# Altium schematic sheet RFID_system.SchDoc
size A4
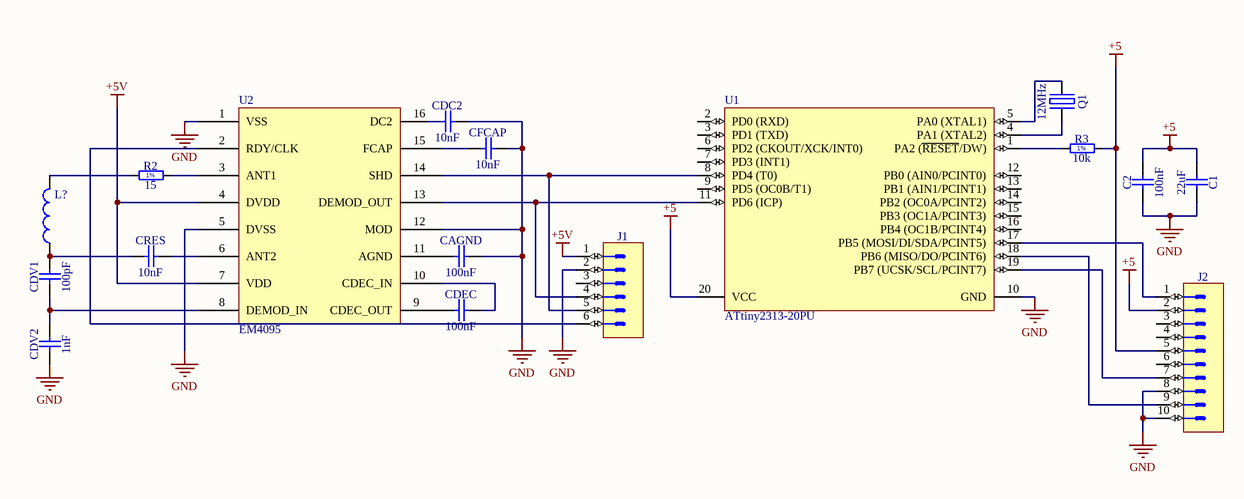
[diagram p0: RFID_system.SchDoc]

## Parts
C1  22uF  [CAPC2012X135N]
C2  100nF  [CAPC2012X135N]
CAGND  100nF  [CAPC2012X135N]
CDC2  10nF  [CAPC2012X135N]
CDEC  100nF  [CAPC2012X135N]
CDV1  100pF  [CAPC2012X88N]
CDV2  1nF  [CAPC2013X100N]
CFCAP  10nF  [CAPC2012X135N]
CRES  10nF  [CAPC2012X135N]
J1  C-Grid III™  [MOLEX_90136-1206]  (value not drawn)
J2  C-Grid®  [MOLEX_70246-1004]  (value not drawn)
L?  (no value)  [0402-A]
Q1  12MHz  [XTAL_TXC_7A]
R2  15  [RESC3216X65N]
R3  10k  [RESC3216X65N]
U1  ATtiny2313-20PU  [20P3]
U2  EM4095

## Nets
+5: C1.1 C2.2 J2.2 J2.5 R3.1 U1.20(VCC)
+5V: J1.1 U2.4(DVDD) U2.7(VDD)
GND: C1.2 C2.1 CAGND.2 CDC2.2 CDV2.1 CFCAP.2 J1.2 J2.8 J2.10 U1.10(GND) U2.1(VSS) U2.5(DVSS) U2.12(MOD)
NetCAGND_1: CAGND.1 U2.11(AGND)
NetCDC2_1: CDC2.1 U2.16(DC2)
NetCDEC_1: CDEC.1 U2.9(CDEC_OUT)
NetCDEC_2: CDEC.2 U2.10(CDEC_IN)
NetCDV1_1: CDV1.1 CDV2.2 U2.8(DEMOD_IN)
NetCDV1_2: CDV1.2 CRES.1 L?.1
NetCFCAP_1: CFCAP.1 U2.15(FCAP)
NetCRES_2: CRES.2 U2.6(ANT2)
NetJ1_4: J1.4 U1.11(PD6_(ICP)) U2.13(DEMOD_OUT)
NetJ1_5: J1.5 U1.8(PD4_(T0)) U2.14(SHD)
NetJ1_6: J1.6 U2.2(RDY/CLK)
NetJ2_1: J2.1 U1.17(PB5_(MOSI/DI/SDA/PCINT5))
NetJ2_7: J2.7 U1.19(PB7_(UCSK/SCL/PCINT7))
NetJ2_9: J2.9 U1.18(PB6_(MISO/DO/PCINT6))
NetL?_2: L?.2 R2.1
NetQ1_1: Q1.1(OSC1) U1.5(PA0_(XTAL1))
NetQ1_2: Q1.2(OSC2) U1.4(PA1_(XTAL2))
NetR2_2: R2.2 U2.3(ANT1)
NetR3_2: R3.2 U1.1(PA2_(~{RESET}/DW))

Not connected (* = marked no-connect by the designer): J1 3; J2 3 4 6; U1 2(PD0_(RXD)) 3(PD1_(TXD)) 6(PD2_(CKOUT/XCK/INT0)) 7(PD3_(INT1)) 9(PD5_(OC0B/T1)) 12(PB0_(AIN0/PCINT0)) 13(PB1_(AIN1/PCINT1)) 14(PB2_(OC0A/PCINT2)) 15(PB3_(OC1A/PCINT3)) 16(PB4_(OC1B/PCINT4))

## Notes on the sheet
- (in symbol R1206_10K_1%_0.5W_100PPM_VISHAY_CRCW-HP e3) 1%

## Library data of the parts
C1 = CC0805_22UF_16V_10%_X5R: Non-polarised capacitor; Part Description: SMD Multilayer Chip Ceramic Capacitor; Manufacturer: GENERIC; Manufacturer1 Part Number: C2012X5R1C226KT; Voltage: 16V; TC: X5R; Tolerance: ±10%; Part Number: CC0805_22UF_16V_10%_X5R; Component Kind: Standard; Component Type: Standard; Pin Count: 2; Value: 22uF; Status: Preferred; Manufacturer Part Number: CC0805_22UF_16V_10%_X5R; Case: 0805; Mounted: Yes; Socket: No; SMD: Yes; Sense: No; Manufacturer1 Example: TDK; Manufacturer1 ComponentHeight: 1.35mm; HelpURL: \\cern.ch\dfs\Applications\Altium\Datasheets\CC0805_X5R_TDK_C.pdf; Author: CERN DEM JLC; CreateDate: 2012-10-25; LatestRevisionDate: 2012-10-25
C2 CAGND CDEC = CC0805_100NF_50V_10%_X7R: Non-polarised capacitor; Part Description: SMD Multilayer Chip Ceramic Capacitor; Manufacturer: GENERIC; Manufacturer1 Part Number: C2012X7R1H104K085AA; Voltage: 50V; TC: X7R; Tolerance: ±10%; Part Number: CC0805_100NF_50V_10%_X7R; Component Kind: Standard; Component Type: Standard; Pin Count: 2; Value: 100nF; Status: Preferred; Manufacturer Part Number: CC0805_100NF_50V_10%_X7R; Case: 0805; Mounted: Yes; Socket: No; SMD: Yes; Sense: No; Manufacturer1 Example: TDK; Manufacturer1 ComponentHeight: 1mm; HelpURL: \\cern.ch\dfs\Applications\Altium\Datasheets\CC0805_X7R_TDK_C.pdf; Author: CERN DEM JLC; CreateDate: 2007-12-03; LatestRevisionDate: 2015-04-22
CDC2 CFCAP CRES = CC0805_10NF_50V_5%_X7R: Non-polarised capacitor; Part Description: SMD Multilayer Chip Ceramic Capacitor; Manufacturer: GENERIC; Manufacturer1 Part Number: 08055C103JAT2A; Voltage: 50V; TC: X7R; Tolerance: ±5%; Part Number: CC0805_10NF_50V_5%_X7R; Component Kind: Standard; Component Type: Standard; Pin Count: 2; Value: 10nF; Status: None; Manufacturer Part Number: CC0805_10NF_50V_5%_X7R; Case: 0805; Mounted: Yes; Socket: No; SMD: Yes; Sense: No; Manufacturer1 Example: AVX; Manufacturer1 ComponentHeight: 0.94mm; HelpURL: \\cern.ch\dfs\Applications\Altium\Datasheets\CC0805_X7R_AVX.pdf; Author: CERN DEM JLC; CreateDate: 2011-01-18; LatestRevisionDate: 2011-01-18
CDV1 = CC0805_100PF_50V_5%_C0G_KEMET_C0805C101J5GACAUTO: Non-polarised capacitor; Part Description: SMD Multilayer Chip Ceramic Capacitor (Automotive Grade); Manufacturer: KEMET; Voltage: 50V; TC: C0G/NP0; Tolerance: ±5%; Part Number: CC0805_100PF_50V_5%_C0G_KEMET_C0805C101J5GACAUTO; Component Kind: Standard; Component Type: Standard; Pin Count: 2; Value: 100pF; Status: Not Recommended; Manufacturer Part Number: C0805C101J5GACAUTO; Case: 0805; Mounted: Yes; Socket: No; SMD: Yes; Sense: No; ComponentHeight: 0.88mm; HelpURL: \\cern.ch\dfs\Applications\Altium\Datasheets\CC0805_KEMET_C0805C101J5GACAUTO.pdf; Author: CERN DEM BC; CreateDate: 2016-02-26; LatestRevisionDate: 2016-02-26
CDV2 = CC0805_1NF_25V_1%_C0G: Non-polarised capacitor; Part Description: SMD Multilayer Chip Ceramic Capacitor; Manufacturer: GENERIC; Manufacturer1 Part Number: C0805C102F3GACTU; Voltage: 25V; TC: C0G/NP0; Tolerance: ±1%; Part Number: CC0805_1NF_25V_1%_C0G; Component Kind: Standard; Component Type: Standard; Pin Count: 2; Value: 1nF; Status: None; Manufacturer Part Number: CC0805_1NF_25V_1%_C0G; Case: 0805; Mounted: Yes; Socket: No; SMD: Yes; Sense: No; Manufacturer1 Example: KEMET; Manufacturer1 ComponentHeight: 0.88mm; HelpURL: \\cern.ch\dfs\Applications\Altium\Datasheets\CC0805_C0G_KEMET_(Commercial Grade).pdf; Author: CERN DEM JLC; CreateDate: 2015-03-11; LatestRevisionDate: 2015-03-11
J1 = MOLEX_90136-1206: Connector 6 Male; Part Description: 2.54mm (.100") Pitch C-Grid III™ Header, Single Row, Vertical, Shrouded, 6 Circuits; Manufacturer: MOLEX; PressFit: No; Part Number: MOLEX_90136-1206; Component Kind: Standard; Component Type: Standard; Pin Count: 6; Family: C-Grid III™; Mounted: Yes; Socket: No; SMD: No; Sense: No; Status: None; Manufacturer Part Number: 90136-1206; ComponentHeight: 11.1mm; HelpURL: \\cern.ch\dfs\Applications\Altium\Datasheets\MOLEX_90136-1206.pdf; Author: CERN DEM JLC; CreateDate: 2008-08-20; LatestRevisionDate: 2008-08-20
J2 = MOLEX_70246-1004: Connector 10 Male; Part Description: 2.54mm Pitch C-Grid® Header, Low Profile, Dual Row, Vertical, Shrouded Header; Manufacturer: MOLEX; PressFit: No; Part Number: MOLEX_70246-1004; Component Kind: Standard; Component Type: Standard; Pin Count: 10; Family: C-Grid®; Mounted: Yes; Socket: No; SMD: No; Sense: No; Status: None; Manufacturer Part Number: 70246-1004; ComponentHeight: 9.27mm; HelpURL: \\cern.ch\dfs\Applications\Altium\Datasheets\MOLEX_70246-1004.pdf; Author: CERN DEM JLC; CreateDate: 2013-08-14; LatestRevisionDate: 2013-08-14
L? = Inductor: Code_IEC: 1005; Published: 8-Jun-2000; LatestRevisionDate: 29-May-2009; LatestRevisionNote: IPC-7351 Footprint Added.; PackageReference: 0402-A; Publisher: Altium Limited; PackageDescription: Chip Inductor; Code_JEITA: 0402
Q1 = XTAL_12MHZ_TXC_7A-12.000MAAJ-T: Quartz Crystal; Part Description: Tolerance: ±30ppm, Stability: ±30ppm, -20°C to +70°C, 18pF, SMD Glass Seam Sealing Crystal, 7A Series; Manufacturer: TXC CORPORATION; PressFit: No; Bonding: No; Part Number: XTAL_12MHZ_TXC_7A-12.000MAAJ-T; Component Kind: Standard; Component Type: Standard; PackageDescription: 2 Pins, 3.2x5mm, SMD Glass Seam Sealing Crystal, 7A Serie; Value: 12MHz; Manufacturer Part Number: 7A-12.000MAAJ-T; Pin Count: 2; Mounted: Yes; Socket: No; SMD: Yes; Sense: No; ComponentHeight: 1.2mm; HelpURL: \\cern.ch\dfs\Applications\Altium\Datasheets\XTAL_TXC_7A.pdf; Author: CERN DEM JLC; CreateDate: 2014-11-12; LatestRevisionDate: 2014-11-12
R2 R3 = R1206_10K_1%_0.5W_100PPM_VISHAY_CRCW-HP e3: Resistor - 1%; Part Description: Pulse Proof, High Power Thick Film Chip Resistor; Manufacturer: VISHAY DRALORIC; Manufacturer Part Number: CRCW120610K0FKEAHP; Power: 0.5W; TC: ±100ppm/°C; Voltage: 200V; PressFit: No; Part Number: R1206_10K_1%_0.5W_100PPM_VISHAY_CRCW-HP e3; Component Kind: Standard; Component Type: Standard; Pin Count: 2; Status: None; Tolerance: ±1%; Case: 1206; Mounted: Yes; Sense: No; Socket: No; SMD: Yes; ComponentHeight: 0.65mm; HelpURL: \\cern.ch\dfs\Applications\Altium\Datasheets\R1206_VISHAY_CRCW-HP e3.pdf; Author: CERN DEM JLC; CreateDate: 2014-05-13; LatestRevisionDate: 2014-05-13
  R2: Value: 15
  R3: Value: 10k
U1 = ATtiny2313-20PU: Low Power tinyAVR® 8-Bit Microcontroller, 2K Flash Memory, 20MHz, Industrial Temperature, 20-Lead PDIP, Pb-Free; Published: 20-Nov-2009; DatasheetVersion: DOC2543B, Mar-2009; PackageVersion: revC, Jan-2004; PackageReference: 20P3; Publisher: Altium Limited; PackageDescription: 20-lead (0.300"/7.62mm Wide) Plastic Dual Inline Package (PDIP); Supplier 1: Digi-Key; Supplier Part Number 1: ATTINY2313-20PU-ND; Supplier 2: Farnell; Supplier Part Number 2: 9171592; Supplier 3: Mouser; Supplier Part Number 3: 556-ATTINY2313-20PU; Code_JEDEC: MS-001-AD; ComponentLink1Description: Manufacturer Link; ComponentLink1URL: http://www.atmel.com/products/AVR/tinyavr.asp?; ComponentLink2Description: Datasheet; ComponentLink2URL: http://www.atmel.com/dyn/resources/prod_documents/doc2543.pdf; ComponentLink3Description: Atmel.com Home; ComponentLink3URL: http://www.atmel.com